# Altium project AD.PrjPcb
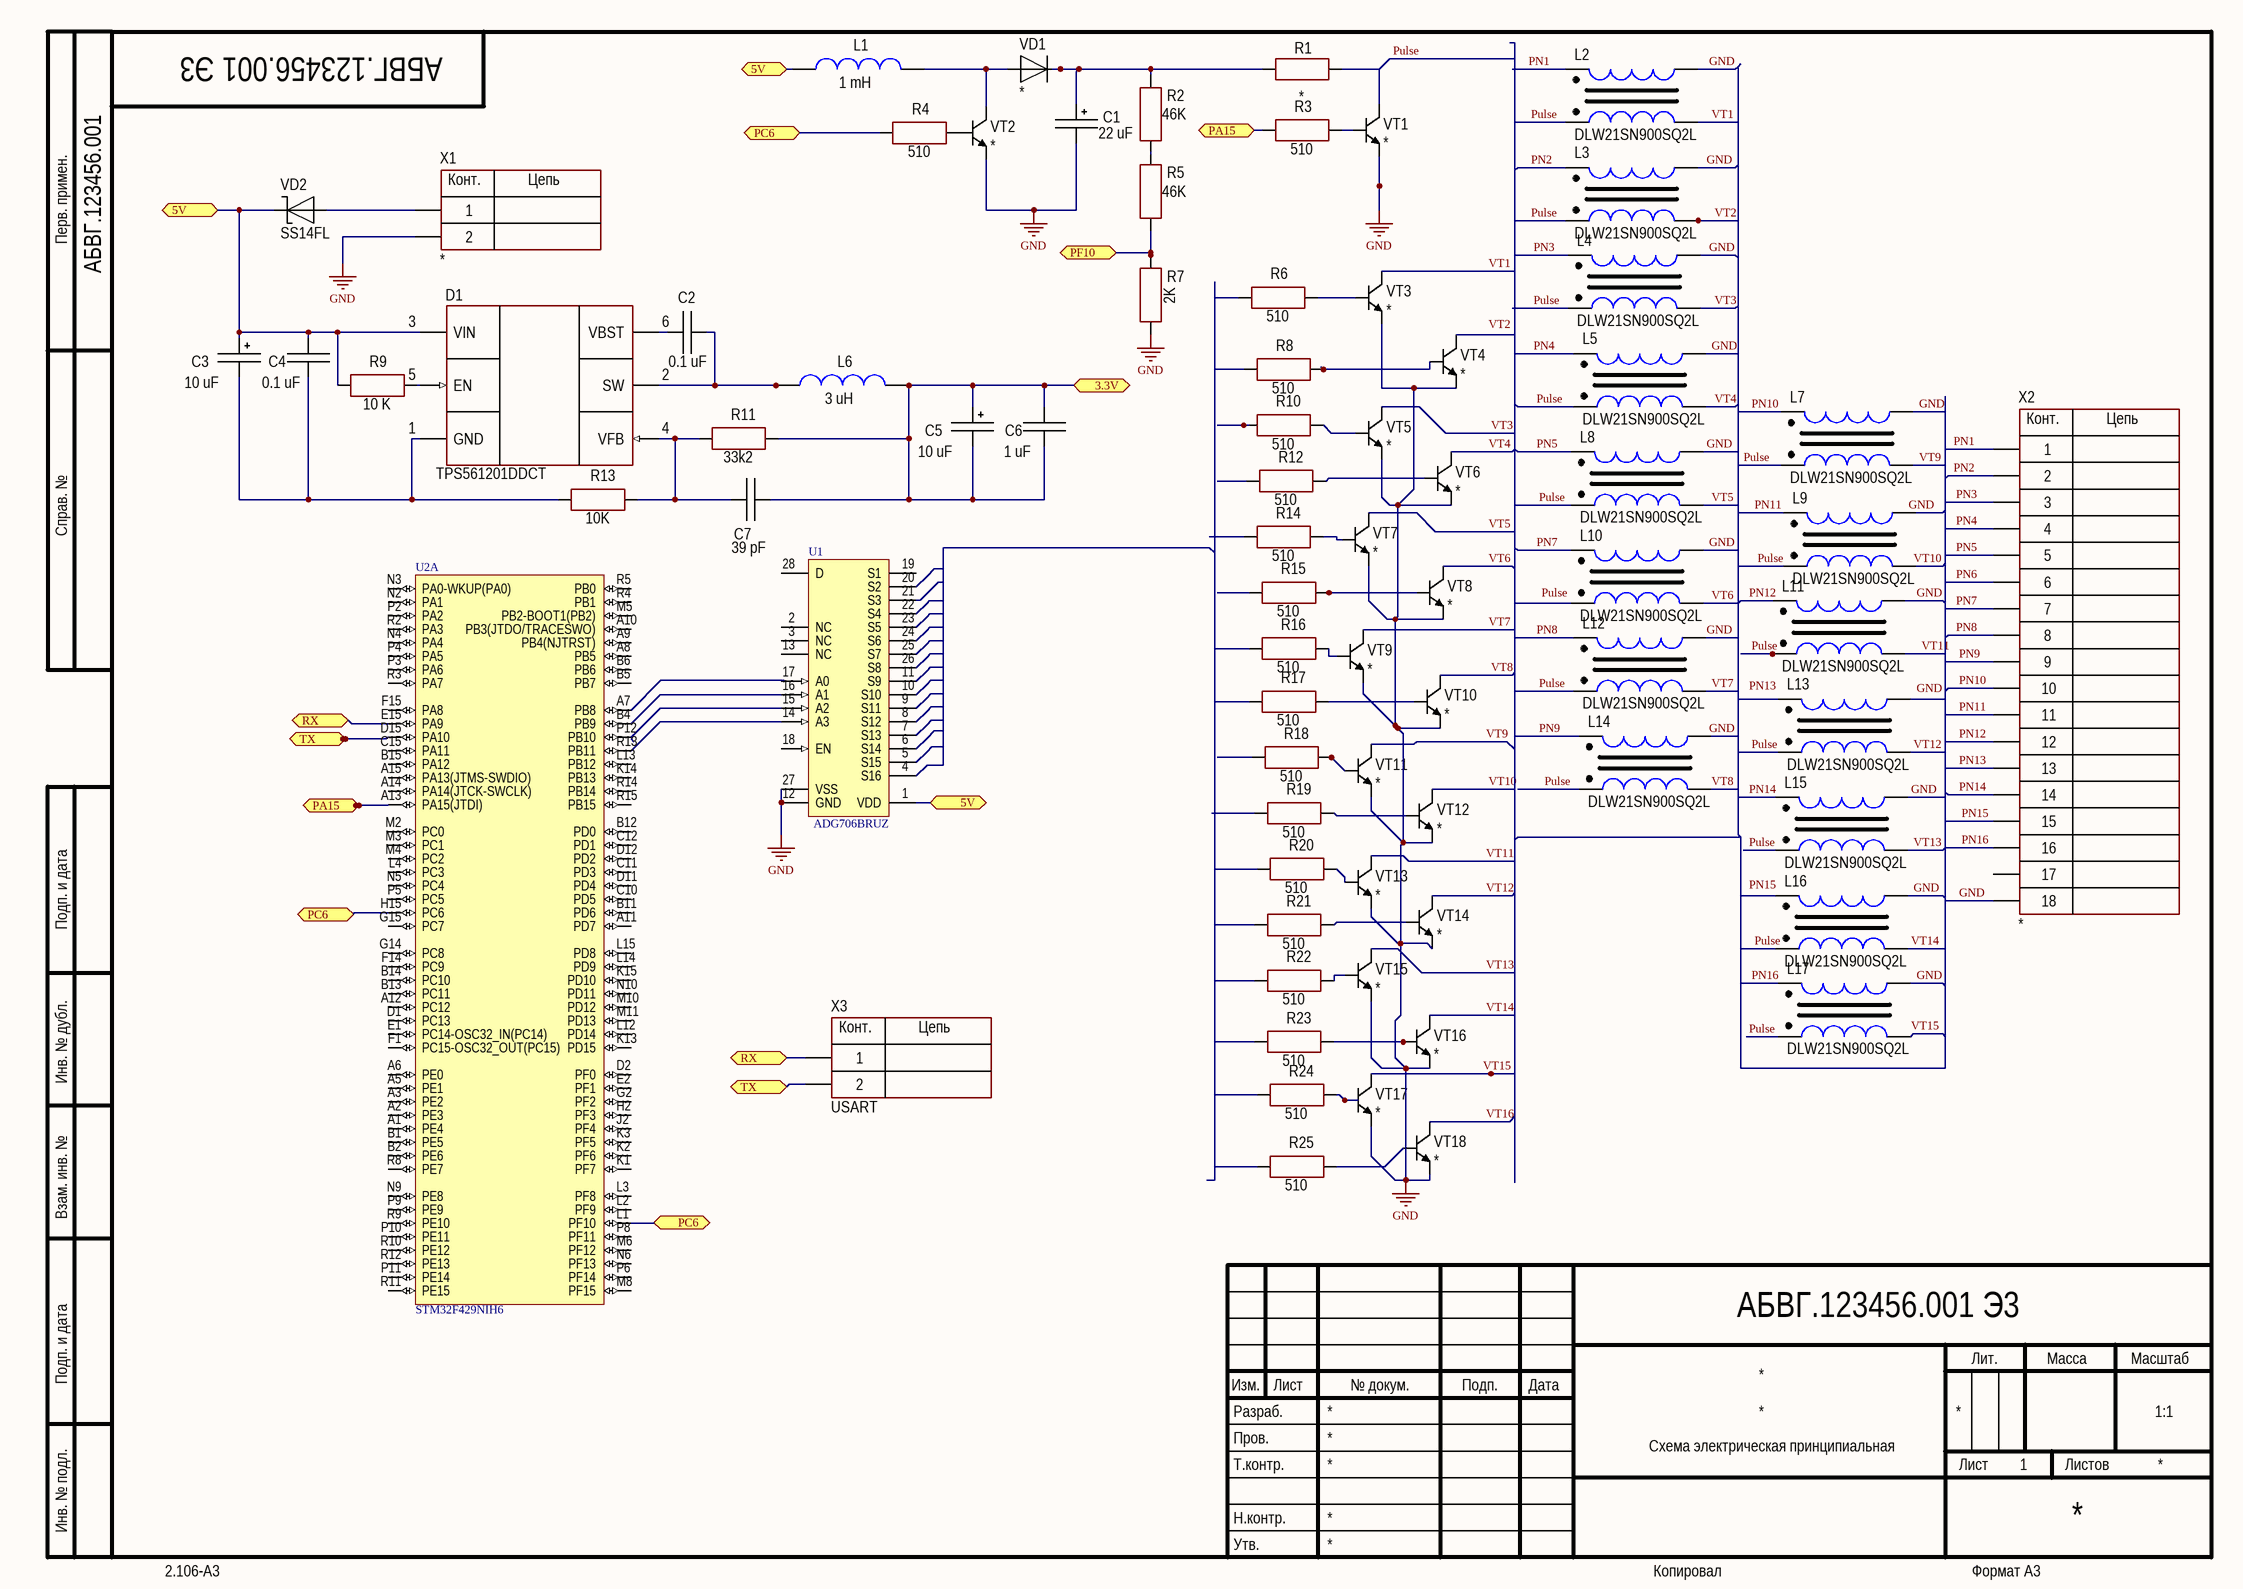
[diagram p0: p1.SchDoc]
1 sheet, 75 parts. Net scope: flat (ports and power ports of the same name join across sheets).
Board file: PCB1.PcbDoc

## Sheet p1.SchDoc
size 420 x 297 mm; Address1: Address1; Address2: Address2; Address3: Address3; Address4: Address4; DocumentNumber: АБВГ.123456.001 Э3; SheetNumber: 1; Scale: 1:1; DocumentType: Схема электрическая принципиальная; FirstReferrence: АБВГ.123456.001

### Parts
C1  22 uF  [TANTAL_A]
C2  0.1 uF  [CH0603C]
C3  10 uF  [TANTAL_A]
C4  0.1 uF  [CH0603C]
C5  10 uF  [TANTAL_A]
C6  1 uF  [CH0603C]
C7  39 pF  [CH0603C]
D1  TPS561201DDCT  [SOT23-6]
L1  1 mH  [IND: SDR0403]
L2  DLW21SN900SQ2L  [TRANS: DLW21]
L3  DLW21SN900SQ2L  [TRANS: DLW21]
L4  DLW21SN900SQ2L  [TRANS: DLW21]
L5  DLW21SN900SQ2L  [TRANS: DLW21]
L6  3 uH  [IND: SDR0403]
L7  DLW21SN900SQ2L  [TRANS: DLW21]
L8  DLW21SN900SQ2L  [TRANS: DLW21]
L9  DLW21SN900SQ2L  [TRANS: DLW21]
L10  DLW21SN900SQ2L  [TRANS: DLW21]
L11  DLW21SN900SQ2L  [TRANS: DLW21]
L12  DLW21SN900SQ2L  [TRANS: DLW21]
L13  DLW21SN900SQ2L  [TRANS: DLW21]
L14  DLW21SN900SQ2L  [TRANS: DLW21]
L15  DLW21SN900SQ2L  [TRANS: DLW21]
L16  DLW21SN900SQ2L  [TRANS: DLW21]
L17  DLW21SN900SQ2L  [TRANS: DLW21]
R1  *  [CH0603R]
R2  46K  [CH0603R]
R3  510  [CH0603R]
R4  510  [CH0603R]
R5  46K  [CH0603R]
R6  510  [CH0603R]
R7  2K  [CH0603R]
R8  510  [CH0603R]
R9  10 K  [CH0603R]
R10  510  [CH0603R]
R11  33k2  [CH0603R]
R12  510  [CH0603R]
R13  10K  [CH0603R]
R14  510  [CH0603R]
R15  510  [CH0603R]
R16  510  [CH0603R]
R17  510  [CH0603R]
R18  510  [CH0603R]
R19  510  [CH0603R]
R20  510  [CH0603R]
R21  510  [CH0603R]
R22  510  [CH0603R]
R23  510  [CH0603R]
R24  510  [CH0603R]
R25  510  [CH0603R]
U1  ADG706BRUZ  [ADI-RU-28_N]
U2  STM32F429NIH6  [STM-TFBGA216]  (part A of 3)
VD1  *  [SOD123]
VD2  SS14FL  [SOD123F]
VT1  *  [SOT89_123]
VT2  *  [SOT89_123]
VT3  *  [SOT89_123]
VT4  *  [SOT89_123]
VT5  *  [SOT89_123]
VT6  *  [SOT89_123]
VT7  *  [SOT89_123]
VT8  *  [SOT89_123]
VT9  *  [SOT89_123]
VT10  *  [SOT89_123]
VT11  *  [SOT89_123]
VT12  *  [SOT89_123]
VT13  *  [SOT89_123]
VT14  *  [SOT89_123]
VT15  *  [SOT89_123]
VT16  *  [SOT89_123]
VT17  *  [SOT89_123]
VT18  *  [SOT89_123]
X1  *  [CON: 0533750210]
X2  *  [CON: IDC-18MS]
X3  USART  [CON: WJ06-02P]

### Ports
3.3V, 5V, PA15, PC6, PF10, RX, TX

### Nets
GND: C1.2 L2.2 L3.2 L4.2 L5.2 L7.2 L8.2 L10.2 L11.2 L12.2 L15.2 L16.2 L17.2 R7.1 U1.12(GND) U1.27(VSS) VT1.3(E) VT2.3(E) VT3.3(E) VT4.3(E) VT5.3(E) VT6.3(E) VT7.3(E) VT8.3(E) VT9.3(E) VT10.3(E) VT11.3(E) VT12.3(E) VT13.3(E) VT14.3(E) VT15.3(E) VT16.3(E) VT17.3(E) VT18.3(E) X1.2 X2.18
PN1: L2.1 X2.1
PN2: L3.1 X2.2
PN3: L4.1 X2.3
PN4: L5.1 X2.4
PN5: L5.4 L8.1 VT6.2(C) X2.5  [also labelled VT4]
PN6: X2.6
PN7: L10.1 X2.7
PN8: L12.1 X2.8
PN9: L14.1 X2.9
PN10: L7.1 X2.10
PN11: L9.1 X2.11
PN12: L10.4 L11.1 VT8.2(C) X2.12  [also labelled VT6]
PN13: X2.13
PN14: L15.1 X2.14
PN15: X2.15
PN16: L15.4 L17.1 VT15.2(C) X2.16  [also labelled VT13]
Pulse: L2.3 L3.3 L4.3 L5.3 L7.3 L8.3 L9.3 L11.3 L12.3 L13.3 L14.3 L15.3 L16.3 L17.3
VT1: L2.4 VT3.2(C)
VT2: L3.4
VT3: L4.4 VT5.2(C)
VT5: L8.4 VT7.2(C)
VT7: L12.4 VT9.2(C)
VT8: L14.4 VT10.2(C)
VT9: L7.4 VT11.2(C)
VT10: VT12.2(C)
VT11: L11.4 VT13.2(C)
VT12: L13.4 VT14.2(C)
VT14: L16.4 VT16.2(C)
VT15: VT17.2(C)
VT16: VT18.2(C)
NetC1_1: C1.1 R1.2 R2.2 VD1.2
NetC2_1: C2.1 D1.6(VBST)
NetC2_2: C2.2 D1.2(SW) L6.2
NetC3_1: C3.1 C4.2 D1.3(VIN) L1.2 R9.1 U1.1(VDD) VD2.2 ; port 5V
NetC3_2: C3.2 C4.1 D1.1(GND) R13.1
NetC5_1: C5.1 C5.2 C6.1 C6.2 C7.1 L6.1 R11.2 ; port 3.3V
NetC7_2: C7.2 D1.4(VFB) R11.1 R13.2
NetD1_5: D1.5(EN) R9.2
NetL1_1: L1.1 VD1.1 VT2.2(C)
NetR1_1: R1.1 VT1.2(C)
NetR2_1: R2.1 R5.2
NetR3_1: R3.1 U2.A13(PA15(JTDI)) ; port PA15
NetR3_2: R3.2 VT1.1(B)
NetR4_1: R4.1 U2.H15(PC6) U2.L1(PF10) ; port PC6
NetR4_2: R4.2 VT2.1(B)
NetR5_1: R5.1 R7.2 ; port PF10
NetR6_2: R6.2 VT3.1(B)
NetR8_2: R8.2 VT4.1(B)
NetR10_2: R10.2 VT5.1(B)
NetR12_2: R12.2 VT6.1(B)
NetR14_2: R14.2 VT7.1(B)
NetR15_2: R15.2 VT8.1(B)
NetR16_2: R16.2 VT9.1(B)
NetR17_2: R17.2 VT10.1(B)
NetR18_2: R18.2 VT11.1(B)
NetR19_2: R19.2 VT12.1(B)
NetR20_2: R20.2 VT13.1(B)
NetR21_2: R21.2 VT14.1(B)
NetR22_2: R22.2 VT15.1(B)
NetR23_2: R23.2 VT16.1(B)
NetR24_2: R24.2 VT17.1(B)
NetR25_2: R25.2 VT18.1(B)
NetU1_14: U1.14(A3) U2.R13(PB11)
NetU1_15: U1.15(A2) U2.P12(PB10)
NetU1_16: U1.16(A1) U2.B4(PB9)
NetU2_D15: U2.D15(PA10) X3.2 ; port TX
NetU2_E15: U2.E15(PA9) X3.1 ; port RX
NetVD2_1: VD2.1 X1.1

Not connected (* = marked no-connect by the designer): L9 2 4; L10 3; L13 1 2; L14 2; L16 1; L17 4; R6 1; R8 1; R10 1; R12 1; R14 1; R15 1; R16 1; R17 1; R18 1; R19 1; R20 1; R21 1; R22 1; R23 1; R24 1; R25 1; U1 2(NC) 3(NC) 4(S16) 5(S15) 6(S14) 7(S13) 8(S12) 9(S11) 10(S10) 11(S9) 13(NC) 17(A0) 18(EN) 19(S1) 20(S2) 21(S3) 22(S4) 23(S5) 24(S6) 25(S7) 26(S8) 28(D); U2 A1(PE4) A2(PE3) A3(PE2) A5(PE1) A6(PE0) A7(PB8) A8(PB5) A9(PB4(NJTRST)) A10(PB3(JTDO/TRACESWO)) A11(PD7) A12(PC12) A14(PA14(JTCK-SWCLK)) A15(PA13(JTMS-SWDIO)) B1(PE5) B2(PE6) B5(PB7) B6(PB6) B11(PD6) B12(PD0) B13(PC11) B14(PC10) B15(PA12) C10(PD5) C11(PD3) C12(PD1) C15(PA11) D1(PC13) D2(PF0) D11(PD4) D12(PD2) E1(PC14-OSC32_IN(PC14)) E2(PF1) F1(PC15-OSC32_OUT(PC15)) F14(PC9) F15(PA8) G2(PF2) G14(PC8) G15(PC7) H2(PF3) J2(PF4) K1(PF7) K2(PF6) K3(PF5) K13(PD15) K14(PB13) K15(PD10) L2(PF9) L3(PF8) L4(PC3) L12(PD14) L13(PB12) L14(PD9) L15(PD8) M2(PC0) M3(PC1) M4(PC2) M5(PB2-BOOT1(PB2)) M6(PF12) M8(PF15) M10(PD12) M11(PD13) N2(PA1) N3(PA0-WKUP(PA0)) N4(PA4) N5(PC4) N6(PF13) N9(PE8) N10(PD11) P2(PA2) P3(PA6) P4(PA5) P5(PC5) P6(PF14) P8(PF11) P9(PE9) P10(PE11) P11(PE14) R2(PA3) R3(PA7) R4(PB1) R5(PB0) R8(PE7) R9(PE10) R10(PE12) R11(PE15) R12(PE13) R14(PB14) R15(PB15); VT4 2(C); X2 17

### Notes on the sheet
- Labels drawn without touching a wire or pin: GND, PN13, PN15, Pulse, VT2, VT10, VT15
- Перв. примен.
- Справ. №
- Подп. и дата
- Инв. № дубл.
- Взам. инв. №
- Разраб.
- Изм.
- Лист
- № докум.
- Подп.
- Дата
- Лит.
- Масса
- Масштаб
- Пров.
- Т.контр.
- Листов
- Инв. № подл.
- Утв.
- Н.контр.
- 2.106-A3
- Копировал
- Формат А3
- (in symbol 2-Connector) Конт.; Цепь
- (in symbol 18-Connector) Конт.; Цепь

### Library data of the parts
C1 C3 C5 = TantalCap: Manufacturer: *; Model: *; HelpURL: *; ComponentKind: *
  C1: Value: 22 uF
  C3 C5: Value: 10 uF
C2 C4 C6 C7 = Capacitor: Manufacturer: Murata Electronics North America; Model: GCJ188R71E104KA12D; HelpURL: https://www.digikey.com/product-detail/en/murata-electronics-north-america/GCJ188R71E104KA12D/490-16477-1-ND/7363459; ComponentKind: *
  C2 C4: Value: 0.1 uF
  C6: Value: 1 uF
  C7: Value: 39 pF
D1 = TPS561201DDCT: Step-down; Manufacturer: Texas Instruments; Model: TPS561201DDCT; HelpURL: https://www.mouser.co.uk/ProductDetail/Texas-Instruments/TPS561201DDCT?qs=sGAEpiMZZMtitjHzVIkrqZzDzZChF5ZstqCcjzfjpVJKulhJ5HbziQ%3d%3d; ComponentKind: SOT23-6
L1 L6 = Inductor: Manufacturer: *; Model: *; HelpURL: *; ComponentKind: *
  L1: Value: 1 mH
  L6: Value: 3 uH
L2-L5 L7-L17 = EMI bead: Manufacturer: Murata Electronics North America; Model: DLW21SN900SQ2L; HelpURL: https://www.digikey.com/product-detail/en/murata-electronics-north-america/DLW21SN900SQ2L/490-5137-1-ND/1922888; ComponentKind: Bead
R1 R3 R4 R6-R25 = Resistor: Manufacturer: *; Model: *; HelpURL: *; ComponentKind: *
  R1 R6-R10 R12-R25: Value: *
  R3 R4: Value: 510
  R11: Value: 33k2
R2 R5 = Resistor: Value: 51K; Manufacturer: *; Model: *; HelpURL: *; ComponentKind: *
U1 = ADG706BRUZ: 1.8 to 5.5 V / 2.5 V, CMOS Low-Voltage 2.5 Ohm, 16-Channel Multiplexer, -40 to 85 degC, 28-pin SOP (RU-28), Tube; Manufacturer: Analog Devices; Bandwidth (Hz): 25M; Max Analog Signal Range: Vss to Vdd; Ron (ohms): 2.5; Supply V Guar Performance: Dual_(+/-2.5V), Single_(+3V), Single_(+5V); t transition (s): 40n; DatasheetVersion: Rev. A; PackageVersion: Mar-05; PackageReference: RU-28; PackageDescription: 28-Pin Thin Shrink Small Outline Package, Body 9.7 x 4.4 mm, Pitch 0.65 mm; Supplier 1: Digi-Key; Supplier Part Number 1: ADG706BRUZ-ND; Supplier 2: Farnell; Supplier Part Number 2: 9604332; Supplier 3: Newark; Supplier Part Number 3: 19M0682; Supplier 4: Mouser; Supplier Part Number 4: 584-ADG706BRUZ; Packing: Tube; Mounting Technology: Surface Mount; Code_JEDEC: MO-153-AE; PartNumber: ADG706BRUZ; ComponentLink1Description: Manufacturer URL; ComponentLink1URL: http://www.analog.com/en/index.html; ComponentLink2Description: Datasheet; ComponentLink2URL: http://www.analog.com/static/imported-files/data_sheets/ADG706_707.pdf; ComponentLink3Description: Package Specification; ComponentLink3URL: http://www.analog.com/static/imported-files/packages/249854663RU_28.pdf
U2 = STM32F429NIH6: ARM Cortex-M4 32-bit MCU+FPU, 225 DMIPS, 2048 kB Flash, 256 kB Internal RAM, 168 I/Os, 216-pin TFBGA, -40 to 85 degC, Tray; Manufacturer: STMicroelectronics; D/A Converter: 2x12-bit; FLASH Size (Prog) (kB): 2048; I/Os (High Current): 168; Internal RAM Size (kB): 256; Operating Frequency(F) (Processor speed) (MHz): 180; Supply Voltage(Vcc) max (V): 3.6; Supply Voltage(Vcc) min (V): 1.8; DatasheetVersion: Rev. 2; PackageVersion: Rev. 2, 05/2013; PackageReference: TFBGA216; PackageDescription: 216-Ball Ultra Thin Fine Pitch Ball Grid Array, 13 x 13 x 0.8 mm Body, 0.8 mm Pitch; Supplier 1: Mouser; Supplier Part Number 1: N/A; Core: ARM Cortex-M4; Packing: Tray; Mounting Technology: Surface Mount; PartNumber: STM32F429NIH6; ComponentLink1Description: Manufacturer URL; ComponentLink1URL: http://www.st.com/web/en/home.html; ComponentLink2Description: Datasheet; ComponentLink2URL: http://www.st.com/st-web-ui/static/active/en/resource/technical/document/data_brief/DM00053488.pdf; ComponentLink3Description: Package Specification; ComponentLink3URL: http://www.st.com/st-web-ui/static/active/en/resource/technical/document/data_brief/DM00053488.pdf
VD1 = Diod: ComponentKind: *; Manufacturer: *; Model: *; HelpURL: *
VD2 = Diod Schottky: ComponentKind: *; Manufacturer: *; Model: SS14FL; HelpURL: *
VT1-VT18 = NPN: Bipolar; Model: *; Manufacturer: *; ComponentKind: *; HelpURL: *
X1 X3 = 2-Connector: Model: *; Manufacturer: *; HelpURL: *; ComponentKind: *
X2 = 18-Connector: Model: *; Manufacturer: *; HelpURL: *; ComponentKind: *